# Altium project Battery BDC Relay Board P4.PrjPcb
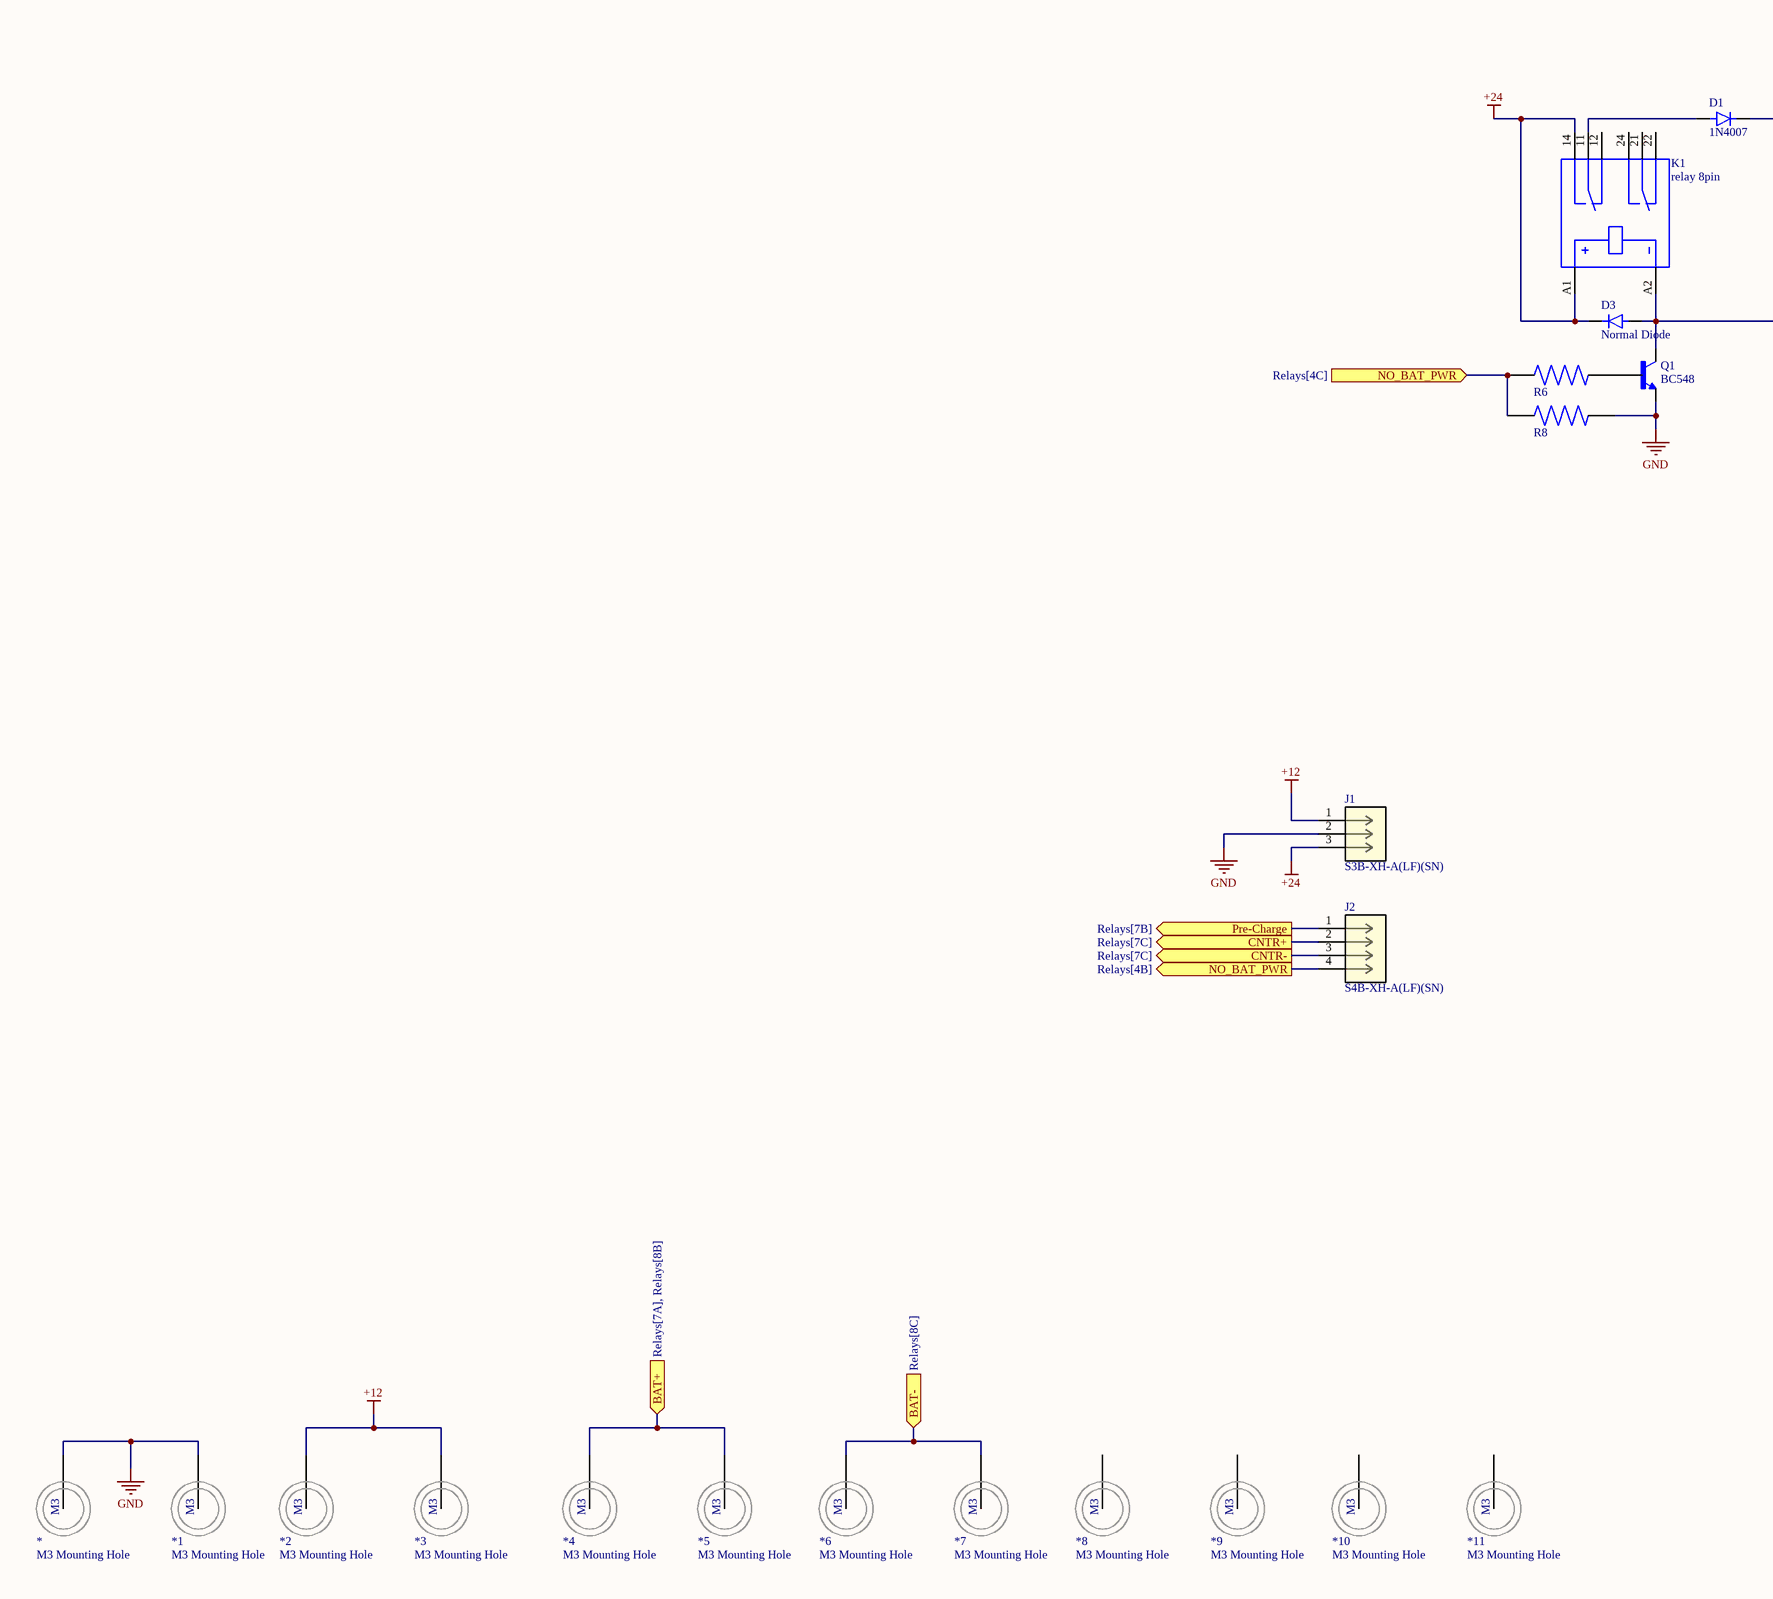
[diagram p0: Relays.SchDoc, left]
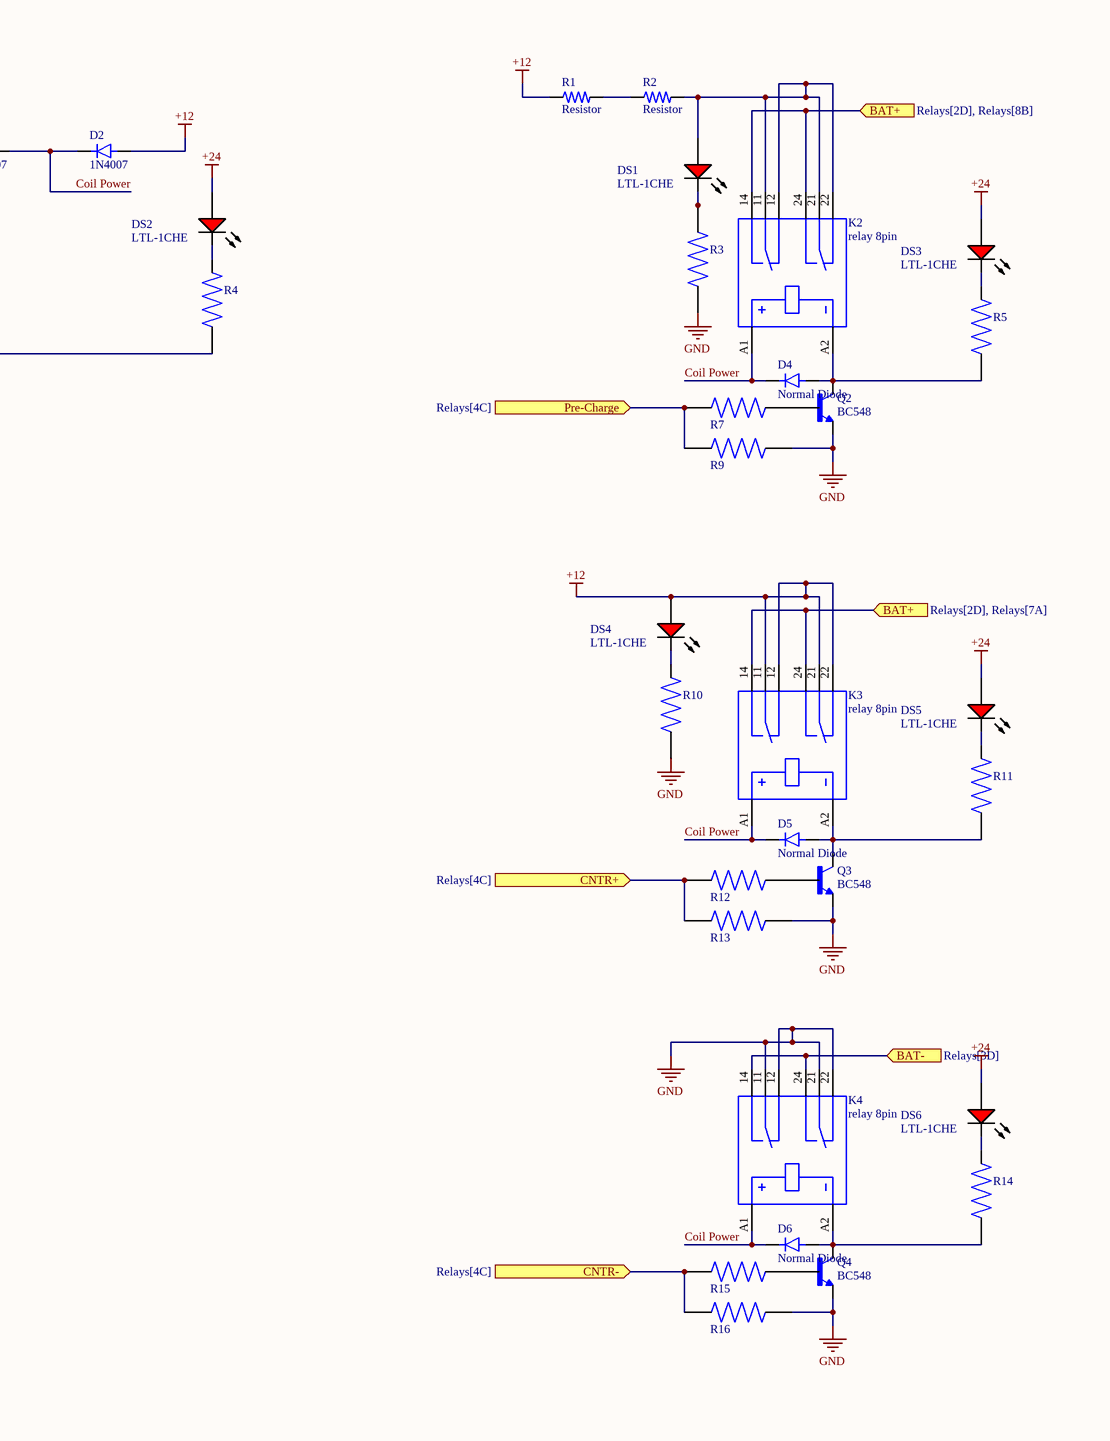
[diagram p1: Relays.SchDoc, right]
1 sheet, 50 parts. Net scope: flat (ports and power ports of the same name join across sheets).
Board files: Relays.PcbDoc, Old.PcbDoc

## Sheet Relays.SchDoc
size A2; SheetNumber: 1; SheetTotal: 1

### Parts
*  M3 Mounting Hole  [M3 - Mounting Hole]
*1  M3 Mounting Hole  [M3 - Mounting Hole]
*2  M3 Mounting Hole  [M3 - Mounting Hole]
*3  M3 Mounting Hole  [M3 - Mounting Hole]
*4  M3 Mounting Hole  [M3 - Mounting Hole]
*5  M3 Mounting Hole  [M3 - Mounting Hole]
*6  M3 Mounting Hole  [M3 - Mounting Hole]
*7  M3 Mounting Hole  [M3 - Mounting Hole]
*8  M3 Mounting Hole  [M3 - Mounting Hole]
*9  M3 Mounting Hole  [M3 - Mounting Hole]
*10  M3 Mounting Hole  [M3 - Mounting Hole]
*11  M3 Mounting Hole  [M3 - Mounting Hole]
D1  1N4007  [Common Trhough Hole]
D2  1N4007  [Common Trhough Hole]
D3  Normal Diode  [Common Trhough Hole]
D4  Normal Diode  [Common Trhough Hole]
D5  Normal Diode  [Common Trhough Hole]
D6  Normal Diode  [Common Trhough Hole]
DS1  LTL-1CHE  [LED_3mm]
DS2  LTL-1CHE  [LED_3mm]
DS3  LTL-1CHE  [LED_3mm]
DS4  LTL-1CHE  [LED_3mm]
DS5  LTL-1CHE  [LED_3mm]
DS6  LTL-1CHE  [LED_3mm]
J1  S3B-XH-A(LF)(SN)  [3P JST XH2.54mm 90º]
J2  S4B-XH-A(LF)(SN)  [4P JST XH2.54mm 90º]
K1  relay 8pin  [Relay socket 8pin]
K2  relay 8pin  [Relay socket 8pin]
K3  relay 8pin  [Relay socket 8pin]
K4  relay 8pin  [Relay socket 8pin]
Q1  BC548  [bc548]
Q2  BC548  [bc548]
Q3  BC548  [bc548]
Q4  BC548  [bc548]
R1  Resistor  [Resistor_Through Hole]
R2  Resistor  [Resistor_Through Hole]
R3  Resistor_Through Hole  [Resistor_Through Hole]  (value not drawn)
R4  Resistor_Through Hole  [Resistor_Through Hole]  (value not drawn)
R5  Resistor_Through Hole  [Resistor_Through Hole]  (value not drawn)
R6  Resistor_Through Hole  [Resistor_Through Hole]  (value not drawn)
R7  Resistor_Through Hole  [Resistor_Through Hole]  (value not drawn)
R8  Resistor_Through Hole  [Resistor_Through Hole]  (value not drawn)
R9  Resistor_Through Hole  [Resistor_Through Hole]  (value not drawn)
R10  Resistor_Through Hole  [Resistor_Through Hole]  (value not drawn)
R11  Resistor_Through Hole  [Resistor_Through Hole]  (value not drawn)
R12  Resistor_Through Hole  [Resistor_Through Hole]  (value not drawn)
R13  Resistor_Through Hole  [Resistor_Through Hole]  (value not drawn)
R14  Resistor_Through Hole  [Resistor_Through Hole]  (value not drawn)
R15  Resistor_Through Hole  [Resistor_Through Hole]  (value not drawn)
R16  Resistor_Through Hole  [Resistor_Through Hole]  (value not drawn)

### Ports
BAT+ (in, see Relays[2D], Relays[7A]), BAT+ (in, see Relays[2D], Relays[8B]), BAT+ (in, see Relays[7A], Relays[8B]), BAT- (in, see Relays[3D]), BAT- (in, see Relays[8C]), CNTR+ (in, see Relays[4C]), CNTR+ (out, see Relays[7C]), CNTR- (in, see Relays[4C]), CNTR- (out, see Relays[7C]), NO_BAT_PWR (in, see Relays[4C]), NO_BAT_PWR (out, see Relays[4B]), Pre-Charge (in, see Relays[4C]), Pre-Charge (out, see Relays[7B])

### Nets
+12: *2.1(M3) *3.1(M3) D2.2(A) DS4.1(A) J1.1 K3.11 K3.12 K3.21 K3.22 R1.1
+24: D3.1(K) DS2.1(A) DS3.1(A) DS5.1(A) DS6.1(A) J1.3 K1.14 K1.A1
GND: *.1(M3) *1.1(M3) J1.2 K4.11 K4.12 K4.21 K4.22 Q1.3(E) Q2.3(E) Q3.3(E) Q4.3(E) R3.2 R8.1 R9.1 R10.2 R13.1 R16.1
Coil Power: D1.1(K) D2.1(K) D4.1(K) D5.1(K) D6.1(K) K2.A1 K3.A1 K4.A1
Net*4_1: *4.1(M3) *5.1(M3) K2.14 K2.24 K3.14 K3.24 ; port BAT+
Net*6_1: *6.1(M3) *7.1(M3) K4.14 K4.24 ; port BAT-
NetD1_2: D1.2(A) K1.11
NetD3_2: D3.2(A) K1.A2 Q1.1(C) R4.2
NetD4_2: D4.2(A) K2.A2 Q2.1(C) R5.2
NetD5_2: D5.2(A) K3.A2 Q3.1(C) R11.2
NetD6_2: D6.2(A) K4.A2 Q4.1(C) R14.2
NetDS1_1: DS1.1(A) K2.11 K2.12 K2.21 K2.22 R2.2
NetDS1_2: DS1.2(K) R3.1
NetDS2_2: DS2.2(K) R4.1
NetDS3_2: DS3.2(K) R5.1
NetDS4_2: DS4.2(K) R10.1
NetDS5_2: DS5.2(K) R11.1
NetDS6_2: DS6.2(K) R14.1
NetJ2_1: J2.1 R7.2 R9.2 ; port Pre-Charge
NetJ2_2: J2.2 R12.2 R13.2 ; port CNTR+
NetJ2_3: J2.3 R15.2 R16.2 ; port CNTR-
NetJ2_4: J2.4 R6.2 R8.2 ; port NO_BAT_PWR
NetQ1_2: Q1.2(B) R6.1
NetQ2_2: Q2.2(B) R7.1
NetQ3_2: Q3.2(B) R12.1
NetQ4_2: Q4.2(B) R15.1
NetR1_2: R1.2 R2.1

Not connected (* = marked no-connect by the designer): *8 1(M3); *9 1(M3); *10 1(M3); *11 1(M3); K1 12(7) 21(3) 22(2) 24(4)

### Library data of the parts
D1 D2 = Normal Diode: MF: NTE Electronics, Inc.; Package: DO-41 NTE Electronics; Check_prices: https://www.snapeda.com/parts/1N4007/NTE+Electronics/view-part/?ref=eda; Value: *; Purchase-URL: https://pricing.snapeda.com/search/part/1N4007/?ref=eda; Availability: In Stock; SnapEDA_Link: https://www.snapeda.com/parts/1N4007/NTE+Electronics/view-part/?ref=snap; MP: 1N4007; Price: None
D3-D6 = Normal Diode: MF: NTE Electronics, Inc.; MP: 1N4007; Package: DO-41 NTE Electronics; Check_prices: https://www.snapeda.com/parts/1N4007/NTE+Electronics/view-part/?ref=eda; Value: *; Purchase-URL: https://pricing.snapeda.com/search/part/1N4007/?ref=eda; Availability: In Stock; SnapEDA_Link: https://www.snapeda.com/parts/1N4007/NTE+Electronics/view-part/?ref=snap; Price: None
DS1-DS6 = RED_LED 3mm: Radial LED, 12.6 mcd, 20 mA, 2 V, -55 to 100 degC, 2-Pin THD, RoHS, Bulk; Shielding: Unshielded; Resistance: 0.045 Ohm; Current Rating: 3.6 A; Tolerance: 20%; PackageReference: LTL-1CHE; PackageDescription: 2-Pin Through Hole Device, Dia 3.8 mm, Pitch 2.54 mm; Case\Package: Radial; Length: 0.97 inch; Width: 0.62 inch; Height: 1.1 inch; Radiation Hardening: No; Lead Pitch: 11.44 mm; ComponentLink1URL: http://www.us.liteon.com/; ComponentLink1Description: Manufacturer URL; RoHSCompliant: true; Packaging: Tray; Mount: Through Hole; Min Operating Temperature: -40 degC; Max Operating Temperature: 130 degC; ComponentLink2URL: https://datasheet.ciiva.com/15117/getdatasheetpartid-187746-15117985.pdf; Package Quantity: 55; ComponentLink2Description: Datasheet; DatasheetVersion: Dec-03
J1 = 3P JST XH2.54mm 90º: No Description Available; Mfr_Name: JST; Copyright: Copyright (C) 2024 Ultra Librarian. All rights reserved.; Manufacturer_Part_Number: S3B-XH-A(LF)(SN); RefDes: RefDes; Type: DEV
J2 = 4P JST XH2.54mm 90º: No Description Available; Mfr_Name: JST; Copyright: Copyright (C) 2024 Ultra Librarian. All rights reserved.; Manufacturer_Part_Number: S4B-XH-A(LF)(SN); RefDes: RefDes; Type: DEV
K1-K4 = relay 8pin: General Purpose Relay DPDT _2 Form C_ 24VDC Coil Through Hole; MF: TE Connectivity; MP: 1-1393243-0; Package: None; Value: *; Availability: Unavailable; SnapEDA_Link: https://www.snapeda.com/parts/1-1393243-0/TE%20Connectivity%20Potter%20&%20Brumfield%20Relays/view-part/244556/?ref=snap; Price: None
Q1-Q4 = BC548: Bipolar (BJT) Transistor NPN 30V 100mA 300MHz 500mW Through Hole TO-92-3; MF: ON Semiconductor; DigiKey-Purchase-URL: https://snapeda.com/shop?store=DigiKey&id=2007035; MP: BC548; Availability: Warning; Package: TO-92 ON Semiconductor; Value: *; SnapEDA_Link: https://www.snapeda.com/parts/BC548/ON%20Semiconductor/view-part/2007035/?ref=snap; Price: None
R1 R2 = Resistor: Power_Rating: .25 W; MP: 2-2176053-0; Tolerance: 1%; Resistance: .33; MF: TE Connectivity; Price: None; Availability: In Stock; EU_RoHS_Compliance: Compliant with Exemptions; Package: 0805; Value: *; SnapEDA_Link: https://www.snapeda.com/parts/2-2176053-0/TE+Connectivity/view-part/?ref=snap; Check_prices: https://www.snapeda.com/parts/2-2176053-0/TE+Connectivity/view-part/?ref=eda
R3-R16 = Resistor_Through Hole: 1.02 Ohms Â±1% 0.25W, 1/4W Through Hole Resistor Axial Metal Film; MP: MFR-25FTE52-1R; MF: Yageo; Availability: Warning; Value: *; Check_prices: https://www.snapeda.com/parts/MFR-25FTE52-1R/Yageo/view-part/4629919/?ref=eda; Package: Axial Yageo; Price: None; SnapEDA_Link: https://www.snapeda.com/parts/MFR-25FTE52-1R/Yageo/view-part/4629919/?ref=snap; Purchase-URL: https://pricing.snapeda.com/search/part/MFR-25FTE52-1R/?ref=eda